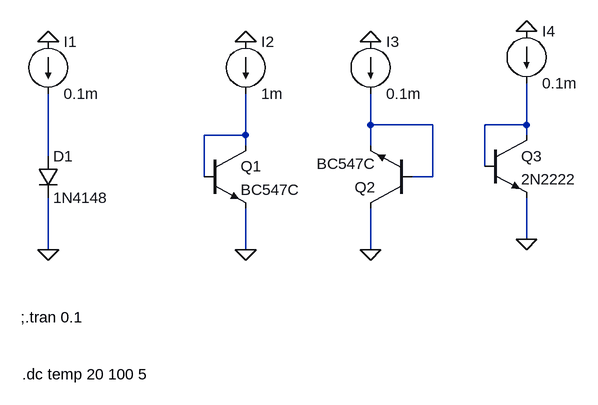
[diagram p0: schematic Draft12.asc]
Draft12.asc, the LTspice schematic file:
Version 4
SHEET 1 1020 680
WIRE 688 128 688 80
WIRE 784 128 688 128
WIRE 928 128 928 64
WIRE 928 128 864 128
WIRE 496 144 496 80
WIRE 496 144 432 144
WIRE 928 144 928 128
WIRE 496 160 496 144
WIRE 688 160 688 128
WIRE 192 176 192 80
WIRE 864 192 864 128
WIRE 432 208 432 144
WIRE 784 208 784 128
WIRE 784 208 752 208
WIRE 928 304 928 240
WIRE 192 320 192 240
WIRE 496 320 496 256
WIRE 688 320 688 256
FLAG 192 320 0
FLAG 192 0 0
FLAG 496 320 0
FLAG 496 0 0
FLAG 688 320 0
FLAG 688 0 0
FLAG 928 304 0
FLAG 928 -16 0
SYMBOL diode 176 176 R0
SYMATTR InstName D1
SYMATTR Value 1N4148
SYMBOL current 192 0 R0
WINDOW 123 0 0 Left 0
WINDOW 39 0 0 Left 0
SYMATTR InstName I1
SYMATTR Value 0.1m
SYMBOL current 496 0 R0
WINDOW 123 0 0 Left 0
WINDOW 39 0 0 Left 0
SYMATTR InstName I2
SYMATTR Value 1m
SYMBOL npn 432 160 R0
SYMATTR InstName Q1
SYMATTR Value BC547C
SYMBOL current 688 0 R0
WINDOW 123 0 0 Left 0
WINDOW 39 0 0 Left 0
SYMATTR InstName I3
SYMATTR Value 0.1m
SYMBOL npn 752 256 R180
SYMATTR InstName Q2
SYMATTR Value BC547C
SYMBOL current 928 -16 R0
WINDOW 123 0 0 Left 0
WINDOW 39 0 0 Left 0
SYMATTR InstName I4
SYMATTR Value 0.1m
SYMBOL npn 864 144 R0
SYMATTR InstName Q3
SYMATTR Value 2N2222
TEXT 150 424 Left 2 !;.tran 0.1
TEXT 152 512 Left 2 !.dc temp 20 100 5

The netlist it stands for:
* Draft12.asc
D1 N004 0 1N4148
I1 0 N004 0.1m
I2 0 N003 1m
Q1 N003 N003 0 0 BC547C
I3 0 N001 0.1m
Q2 0 N001 N001 0 BC547C
I4 0 N002 0.1m
Q3 N002 N002 0 0 2N2222
.model D D
.lib standard.dio
.model NPN NPN
.model PNP PNP
.lib standard.bjt
;.tran 0.1
.dc temp 20 100 5
.backanno
.end